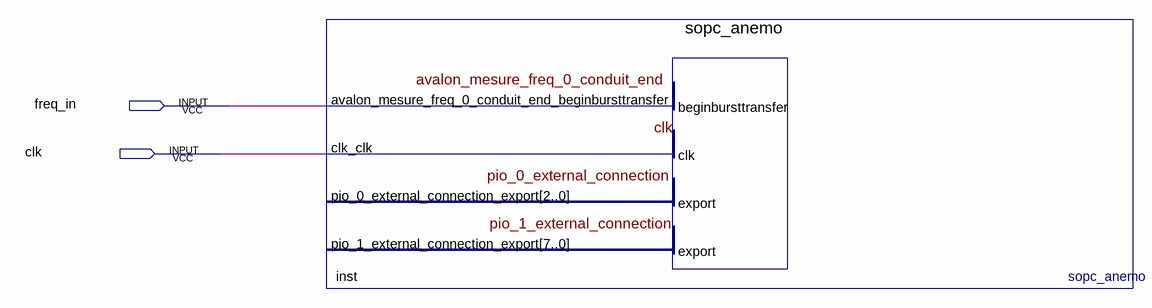
[diagram p0: schematic sheet]
// Quartus schematic anemo_block.bdf as structural Verilog: 1 symbols, 2 pins
module anemo_block (
  input  freq_in,
  input  clk
);

  sopc_anemo inst (
    .avalon_mesure_freq_0_conduit_end_beginbursttransfer(freq_in), .clk_clk(clk));  // open: pio_0_external_connection_export, pio_1_external_connection_export
endmodule
